# Altium schematic sheet Ethernet.SchDoc: uSDR schematic
size Letter; Author: Ye-sheng Kuo; CompanyName: Univ. of Michigan; Revision: 2.0; SheetNumber: 7; SheetTotal: 16
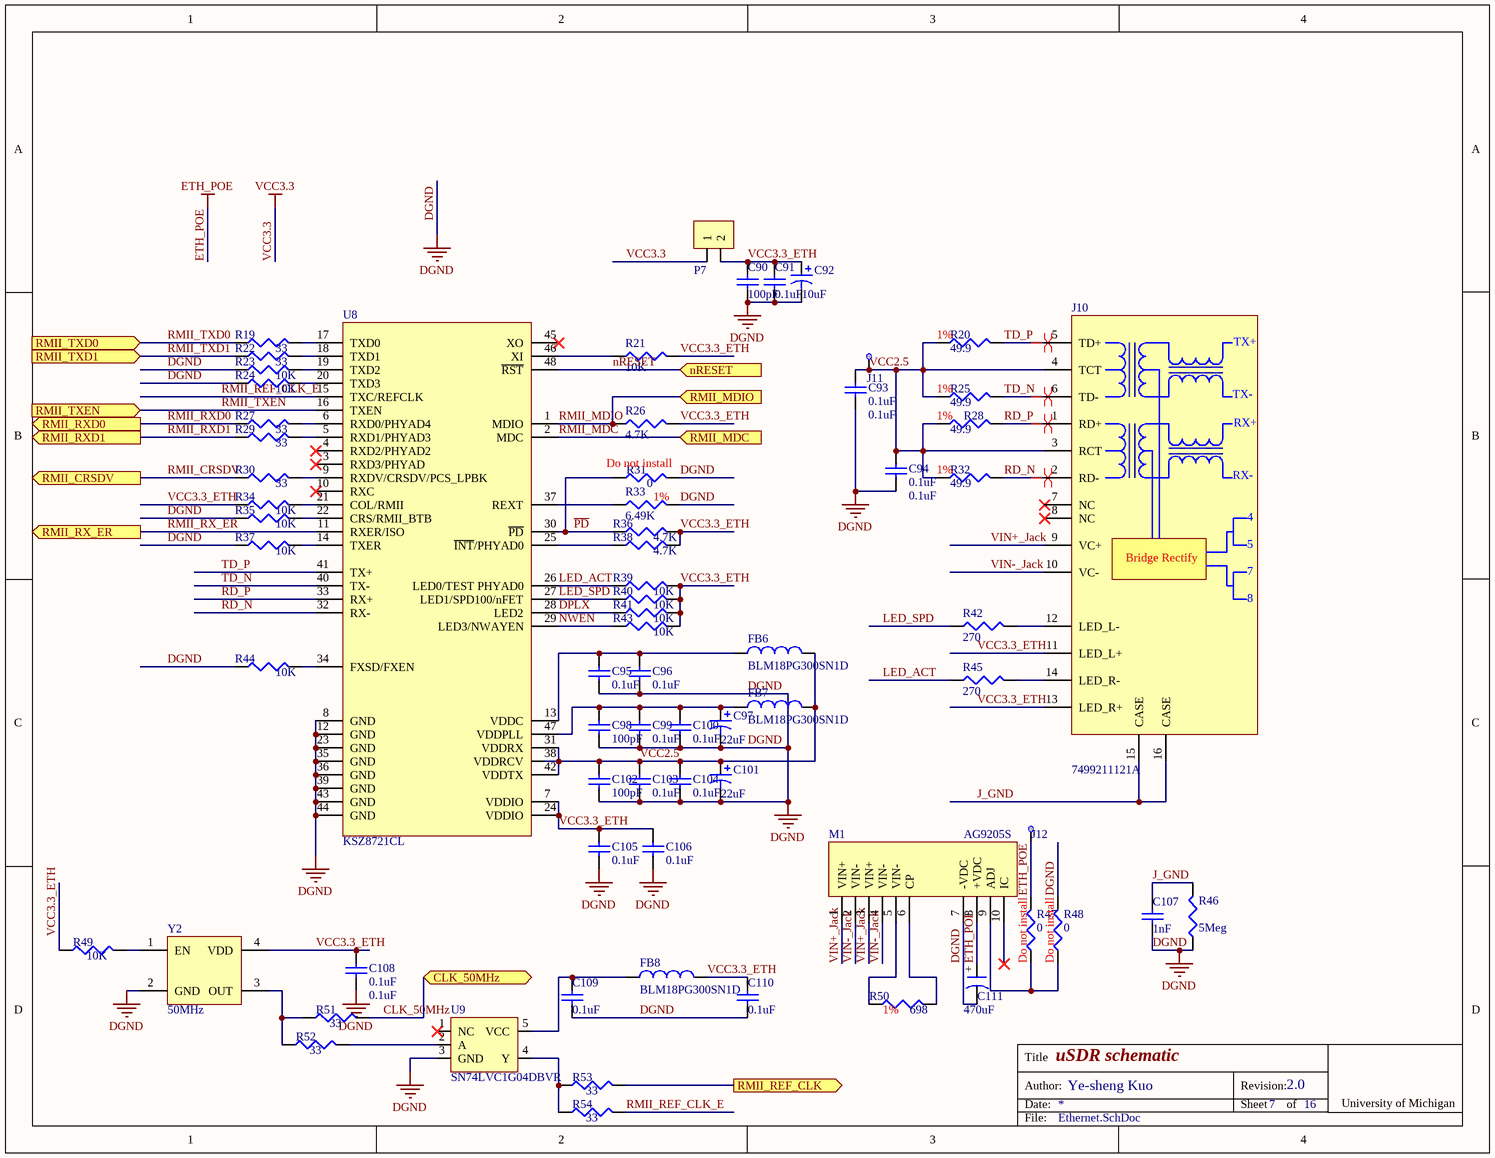
[diagram p0: Ethernet.SchDoc]

## Parts
C90  100pF  [0402]
C91  0.1uF  [0402]
C92  10uF  [C0805]
C93  0.1uF  [0402]
C94  0.1uF  [0402]
C95  0.1uF  [0402]
C96  0.1uF  [0402]
C97  22uF  [C0805]
C98  100pF  [0402]
C99  0.1uF  [0402]
C100  0.1uF  [0402]
C101  22uF  [C0805]
C102  100pF  [0402]
C103  0.1uF  [0402]
C104  0.1uF  [0402]
C105  0.1uF  [0402]
C106  0.1uF  [0402]
C107  1nF  [0402]
C108  0.1uF  [0402]
C109  0.1uF  [0402]
C110  0.1uF  [0402]
C111  470uF  [SMT Al Cap.]
FB6  BLM18PG300SN1D  [1608[0603]]
FB7  BLM18PG300SN1D  [1608[0603]]
FB8  BLM18PG300SN1D  [1608[0603]]
J10  7499211121A  [7499211121A]
J11  5004  [TestPoint]  (value not drawn)
J12  5004  [TestPoint]  (value not drawn)
M1  AG9205S  [AG9205S]
P7  1 x 2 header  [1x2 header]  (value not drawn)
R19  33  [0402]
R20  49.9  [0402]
R21  10K  [0402]
R22  33  [0402]
R23  10K  [0402]
R24  10K  [0402]
R25  49.9  [0402]
R26  4.7K  [0402]
R27  33  [0402]
R28  49.9  [0402]
R29  33  [0402]
R30  33  [0402]
R31  0  [0402]
R32  49.9  [0402]
R33  6.49K  [0402]
R34  10K  [0402]
R35  10K  [0402]
R36  4.7K  [0402]
R37  10K  [0402]
R38  4.7K  [0402]
R39  10K  [0402]
R40  10K  [0402]
R41  10K  [0402]
R42  270  [0402]
R43  10K  [0402]
R44  10K  [0402]
R45  270  [0402]
R46  value 5Meg  [J1-0603]  (hidden comment: 5M)
R47  0  [0402]
R48  0  [0402]
R49  10K  [0402]
R50  698  [0402]
R51  33  [0402]
R52  33  [0402]
R53  33  [0402]
R54  33  [0402]
U8  KSZ8721CL  [TSQFP50P900X900X160-48N]
U9  SN74LVC1G04DBVR  [SOT23-5]
Y2  value 50MHz  [CB3_CB3LV]  (hidden comment: CB3LV-3C-50M0000)

## Ports
CLK_50MHz (bidir), nRESET (in), RMII_CRSDV (out), RMII_MDC (in), RMII_MDIO (in), RMII_REF_CLK (out), RMII_RX_ER (out), RMII_RXD0 (out), RMII_RXD1 (out), RMII_TXD0 (in), RMII_TXD1 (in), RMII_TXEN (in)

## Nets
DGND: C90.1 C91.1 C92.2 C93.1 C94.1 C95.1 C96.1 C97.2 C98.1 C99.1 C100.1 C101.2 C102.1 C103.1 C104.1 C105.1 C106.1 C107.1 C108.1 C109.1 C110.1 C111.- M1.7(-VDC) R23.1 R24.1 R31.2 R33.2 R35.1 R37.1 R44.1 R46.1 R48.2 U8.8(GND) U8.12(GND) U8.23(GND) U8.35(GND) U8.36(GND) U8.39(GND) U8.43(GND) U8.44(GND) U9.3(GND) Y2.2(GND)
ETH_POE: C111.+ J12.1(TB) M1.8(+VDC) R47.2
VCC3.3: P7.1
CLK_50MHz: R51.2 ; port CLK_50MHz
DPLX: R41.1 U8.28(LED2)
J_GND: C107.2 J10.15(CASE) J10.16(CASE) R46.2
LED_ACT: R39.1 R45.1 U8.26(LED0/TEST_PHYAD0)
LED_SPD: R40.1 R42.1 U8.27(LED1/SPD100/nFET)
nRESET: U8.48(~{RST}) ; port nRESET
NWEN: R43.1 U8.29(LED3/NWAYEN)
~{PD}: R31.1 R36.1 U8.30(~{PD})
RD_N: J10.2(RD-) R32.2 U8.32(RX-)
RD_P: J10.1(RD+) R28.2 U8.33(RX+)
RMII_CRSDV: R30.1 ; port RMII_CRSDV
RMII_MDC: U8.2(MDC) ; port RMII_MDC
RMII_MDIO: R26.1 U8.1(MDIO) ; port RMII_MDIO
RMII_REF_CLK: R53.2 ; port RMII_REF_CLK
RMII_REF_CLK_E: R54.2 U8.15(TXC/REFCLK)
RMII_RX_ER: U8.11(RXER/ISO) ; port RMII_RX_ER
RMII_RXD0: R27.1 ; port RMII_RXD0
RMII_RXD1: R29.1 ; port RMII_RXD1
RMII_TXD0: R19.1 ; port RMII_TXD0
RMII_TXD1: R22.1 ; port RMII_TXD1
RMII_TXEN: U8.16(TXEN) ; port RMII_TXEN
TD_N: J10.6(TD-) R25.2 U8.40(TX-)
TD_P: J10.5(TD+) R20.2 U8.41(TX+)
VCC2.5: C93.2 C94.2 C101.1 C102.2 C103.2 C104.2 FB6.2 FB7.2 J10.3(RCT) J10.4(TCT) J11.1(TB) R20.1 R25.1 R28.1 R32.1 U8.31(VDDRX) U8.38(VDDRCV) U8.42(VDDTX)
VCC3.3_ETH: C90.2 C91.2 C92.1 C105.2 C106.2 C108.2 C110.2 FB8.2 J10.11(LED_L+) J10.13(LED_R+) P7.2 R21.2 R26.2 R34.1 R36.2 R38.2 R39.2 R40.2 R41.2 R43.2 R49.1 U8.7(VDDIO) U8.24(VDDIO) Y2.4(VDD)
VIN+_Jack: J10.9(VC+) M1.1(VIN+) M1.3(VIN+)
VIN-_Jack: J10.10(VC-) M1.2(VIN-) M1.4(VIN-)
NetC95_2: C95.2 C96.2 FB6.1 U8.13(VDDC)
NetC97_1: C97.1 C98.2 C99.2 C100.2 FB7.1 U8.47(VDDPLL)
NetC109_2: C109.2 FB8.1 U9.5(VCC)
NetJ10_12: J10.12(LED_L-) R42.2
NetJ10_14: J10.14(LED_R-) R45.2
NetM1_5: M1.5(VIN-) R50.1
NetM1_6: M1.6(CP) R50.2
NetM1_9: M1.9(ADJ) R47.1 R48.1
NetR19_2: R19.2 U8.17(TXD0)
NetR21_1: R21.1 U8.46(XI)
NetR22_2: R22.2 U8.18(TXD1)
NetR23_2: R23.2 U8.19(TXD2)
NetR24_2: R24.2 U8.20(TXD3)
NetR27_2: R27.2 U8.6(RXD0/PHYAD4)
NetR29_2: R29.2 U8.5(RXD1/PHYAD3)
NetR30_2: R30.2 U8.9(RXDV/CRSDV/PCS_LPBK)
NetR33_1: R33.1 U8.37(REXT)
NetR34_2: R34.2 U8.21(COL/RMII)
NetR35_2: R35.2 U8.22(CRS/RMII_BTB)
NetR37_2: R37.2 U8.14(TXER)
NetR38_1: R38.1 U8.25(~{INT}/PHYAD0)
NetR44_2: R44.2 U8.34(FXSD/FXEN)
NetR49_2: R49.2 Y2.1(EN)
NetR51_1: R51.1 R52.1 Y2.3(OUT)
NetR52_2: R52.2 U9.2(A)
NetR53_1: R53.1 R54.1 U9.4(Y)

Not connected (* = marked no-connect by the designer): J10 7(NC)* 8(NC)*; M1 10(IC)*; U8 3(RXD3/PHYAD)* 4(RXD2/PHYAD2)* 10(RXC)* 45(XO)*; U9 1(NC)*

## Layout directives
differential pair: RD_N, RD_P, TD_N, TD_P

## Notes on the sheet
- (near R20) 1%
- (near R25) 1%
- (near R28) 1%
- (near R31) Do not install
- (near R33) 1%
- (near R32) 1%
- (near R47) Do not install
- (near R48) Do not install
- (near R50) 1%
- Title
- Date:
- Author:
- Revision:
- Sheet
- of
- University of Michigan
- File:
- (in symbol Ethernet Jack PoE) TX+; TX-; RX+; RX-; Bridge Rectify

## Library data of the parts
C90 C91 C93-C96 C98-C100 C102-C110 = Cap Semi: Capacitor (Semiconductor SIM Model); Published: 8-Jun-2000; LatestRevisionDate: 29-May-2009; LatestRevisionNote: IPC-7351 Footprint Added.; PackageReference: C1206; Publisher: Altium Limited; PackageDescription: Chip Capacitor
  C90 C98 C102: Value: 100pF
  C91 C93-C96 C99 C100 C103-C106 C108-C110: Value: 0.1uF
  C107: Value: 1nF
C92 C97 C101 = Cap Pol3: Polarized Capacitor (Surface Mount); Published: 8-Jun-2000; LatestRevisionDate: 29-May-2009; LatestRevisionNote: IPC-7351 Footprint Added.; PackageReference: C0805; Publisher: Altium Limited; PackageDescription: Chip Capacitor
  C92: Value: 10uF
  C97 C101: Value: 22uF
C111 = Cap: Value: 470uF; Supplier 1: Digi-Key; Supplier Part Number 1: PCE3184CT-ND
FB6-FB8 = Ferrite Bead: FERRITE CHIP 30 OHM 1000MA 0603; Supplier 1: Digi-Key; Supplier Part Number 1: 490-1035-2-ND
J10 = Ethernet Jack PoE: CONN RJ45 8-8 W/TRANSFORMER; Supplier 1: Digi-Key; Supplier Part Number 1: 732-1654-ND
J11 J12 = TestPoint: TEST POINT PC MINI .040"D YELLOW; Supplier 1: Digi-Key; Supplier Part Number 1: 5004K-ND; datasheet: http://mail.keyelco.com/ENG._DEPT/PDF%20CAT%20NO%20Drawings/5004.pdf
M1 = AG9205S: Silver Telecom AG9205S POE; Value: 5V; datasheet: http://www.silvertel.com/DataSheets/Ag9200v1-7.pdf
P7 = 1 x 2 header: 100 mils standard header
R19-R54 = Res3: Resistor; Published: 8-Jun-2000; LatestRevisionDate: 29-May-2009; LatestRevisionNote: IPC-7351 Footprint Added.; PackageReference: J1-0603; Publisher: Altium Limited; PackageDescription: Chip Resistor
  R19 R22 R27 R29 R30 R51-R54: Value: 33
  R20 R25 R28 R32: Value: 49.9
  R21 R23 R24 R34 R35 R37 R39-R41 R43 R44 R49: Value: 10K
  R26 R36 R38: Value: 4.7K
  R31 R47 R48: Value: 0
  R33: Value: 6.49K
  R42 R45: Value: 270
  R50: Value: 698
U8 = KSZ8721CL: IC TXRX PHY 10/100 3.3V 48-LQFP; Supplier 1: Digi-Key; Supplier Part Number 1: 576-1673-ND
U9 = SN74LVC1G04DBV: IC SINGLE INVERTER-GATE SOT-23-5; Supplier 1: Digi-Key; Supplier Part Number 1: 296-11599-1-ND
Y2 = CB3_CB3LV: OSC 50.000 MHZ 3.3V SMD; Supplier 1: Digi-Key; Supplier Part Number 1: CTX283LVCT-ND